# Altium schematic sheet SCH_Template_A3_by_Power.SchDoc
size A3; Author: Power Lin; SheetNumber: 1; SheetTotal: 1; Website: wiki-power.com
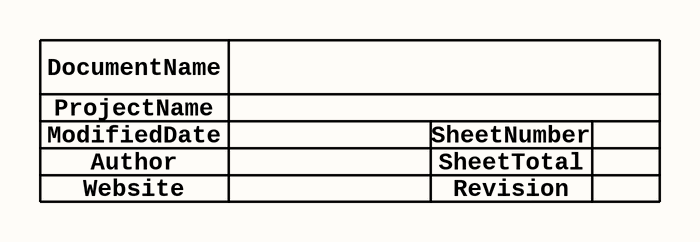
[diagram p0: SCH_Template_A3_by_Power.SchDoc]

## Notes on the sheet
- Author
- DocumentName
- ModifiedDate
- ProjectName
- SheetNumber
- SheetTotal
- Website
- Revision